# EAGLE design kb2040 (EAGLE 9.6.2)
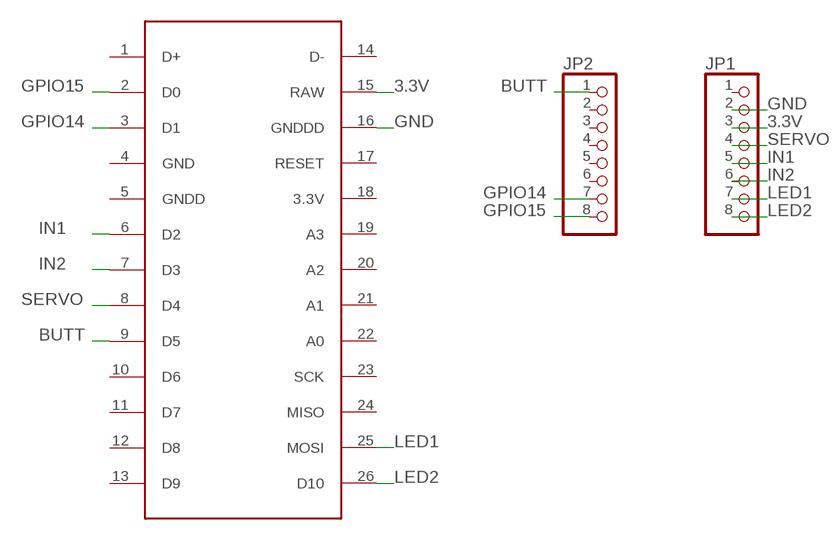
[diagram p0: schematic, sheet 1]

## Parts
JP1  PINHD-1X8  [1X08]
JP2  PINHD-1X8  [1X08]
U$1  KB2040  [KB2040]

## Nets
3.3V: JP1.3 U$1.15(RAW)
BUTT: JP2.1 U$1.9(D5)
GND: JP1.2 U$1.16(GNDDD)
GPIO14: JP2.7 U$1.3(D1)
GPIO15: JP2.8 U$1.2(D0)
IN1: JP1.5 U$1.6(D2)
IN2: JP1.6 U$1.7(D3)
LED1: JP1.7 U$1.25(MOSI)
LED2: JP1.8 U$1.26(D10)
SERVO: JP1.4 U$1.8(D4)
Unconnected: JP1.1 JP2.2 JP2.3 JP2.4 JP2.5 JP2.6 U$1.1(D+) U$1.4(GND) U$1.5(GNDD) U$1.10(D6) U$1.11(D7) U$1.12(D8) U$1.13(D9) U$1.14(D-) U$1.17(RESET) U$1.18(3.3V) U$1.19(A3) U$1.20(A2) U$1.21(A1) U$1.22(A0) U$1.23(SCK) U$1.24(MISO)

## Library data of the parts
JP1 JP2 = pinhead:PINHD-1X8: PIN HEADER
U$1 = KB2040:KB2040

## Board
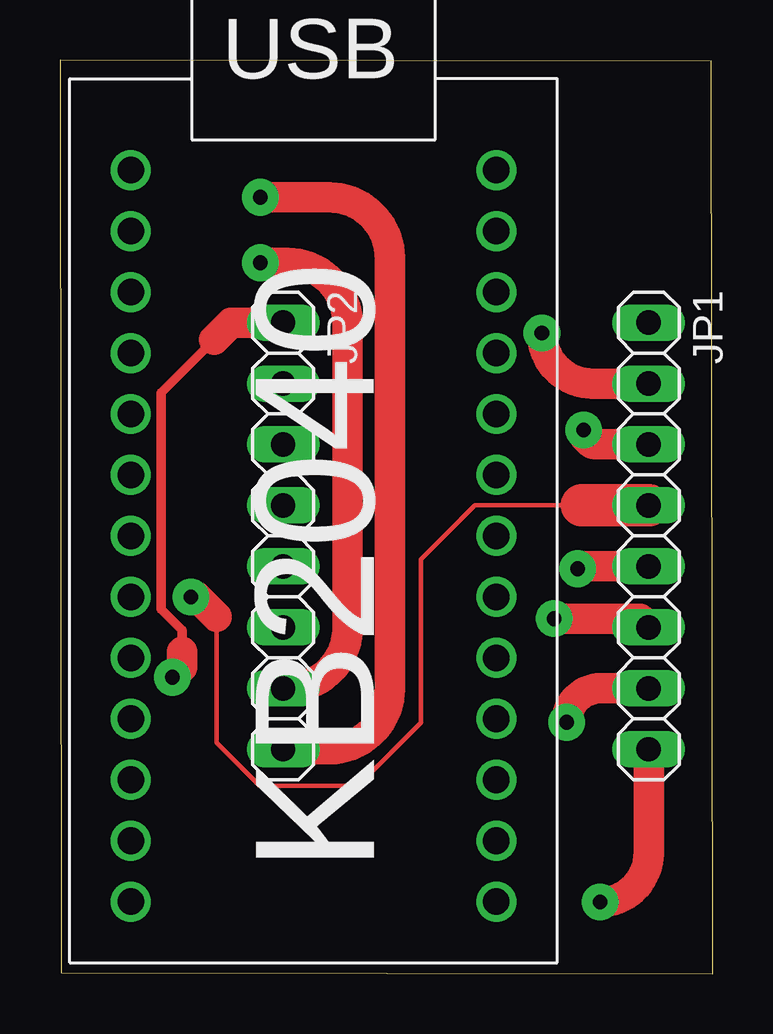
[diagram p1: board, top side]
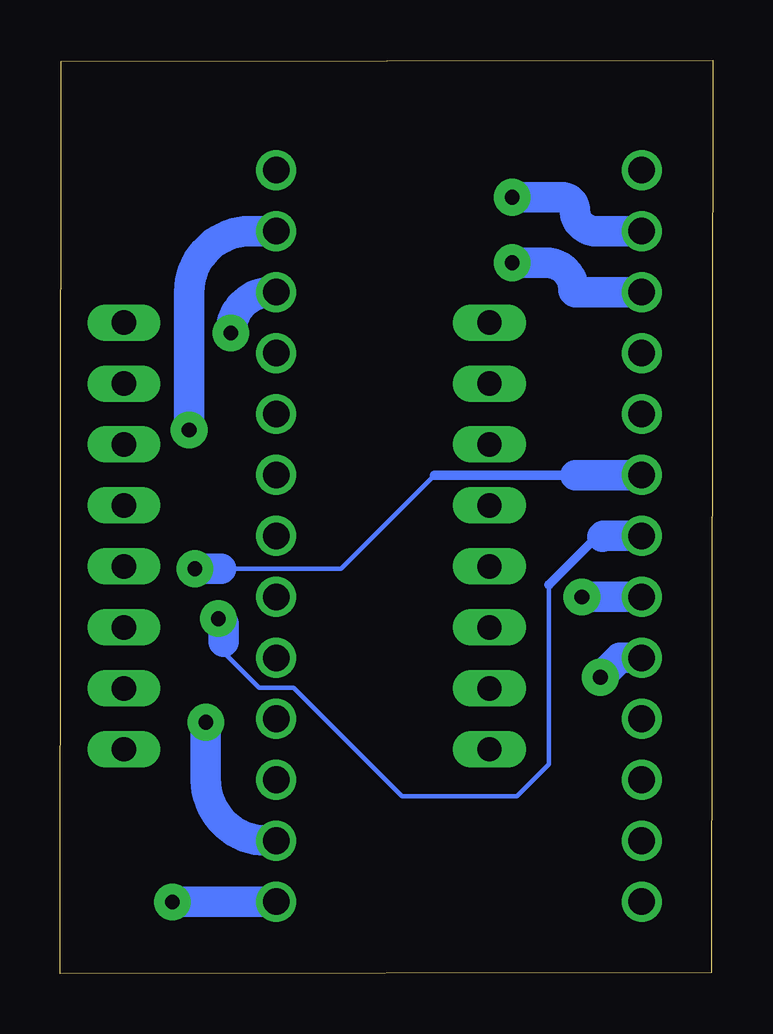
[diagram p2: board, bottom side, seen from below]

Size 27.21 x 38.08 mm. Coordinates in mm from the lower left corner, seen from the top.
Outline: 0.05,0.06 27.21,0 27.16,38.02 0,38.08 0.05,0.06
Copper layers (1*16): Top 0.035mm / dielectric 1.5mm / Bottom 0.035mm
Design rules "default *": minimum track width 6mil, minimum drill 0.35mm, track to track 0.4mm, track to pad 6mil, pad to pad 6mil, via to via 6mil, smd to smd 6mil, copper to edge 40mil, drill to drill 6mil, minimum pad ring 10mil, minimum via ring 8mil, stop-mask expansion 4mil, vias tented up to drill 0mil, thermal gap 10mil

### Footprints (pad centres in the part's own frame; a part is rotated, then mirrored left to right if it is on the bottom)
1X08 = drill 1.016 long: 1 -8.89,0; 2 -6.35,0; 3 -3.81,0; 4 -1.27,0; 5 1.27,0; 6 3.81,0; 7 6.35,0; 8 8.89,0
KB2040 = drill 1.11 pad 1.665: 1 -15.24,-8.89; 2 -12.7,-8.89; 3 -10.16,-8.89; 4 -7.62,-8.89; 5 -5.08,-8.89; 6 -2.54,-8.89; 7 0,-8.89; 8 2.54,-8.89; 9 5.08,-8.89; 10 7.62,-8.89; 11 10.16,-8.89; 12 12.7,-8.89; 13 15.24,-8.89; 14 -15.24,6.35; 15 -12.7,6.35; 16 -10.16,6.35; 17 -7.62,6.35; 18 -5.08,6.35; 19 -2.54,6.35; 20 0,6.35; 21 2.54,6.35; 22 5.08,6.35; 23 7.62,6.35; 24 10.16,6.35; 25 12.7,6.35; 26 15.24,6.35

### Placement (x,y rotation side)
JP1  24.54,18.25 270 top
JP2  9.3,18.25 270 top
U$1  11.84,18.25 270 top

### Tracks (layer width: path | path; a pad name or v marks a point on that pad's centre or on a via)
3.3V  (via drill 0.61 pad 1.52)
  Top 1.27: v21.83,22.66 arc90 22.42,22.06 JP1.3
  Bottom 1.27: U$1.15 19.29,30.95 arc-90 21.83,28.41 v21.83,22.66
BUTT  (via drill 0.61 pad 1.52)
  Top 0.4: 5.1,13.43 5.1,14.32 4.22,15.2 4.22,24.21 6.44,26.43
  Top 1.27: v4.68,12.36 5.1,12.78 5.1,13.43 | 6.44,26.43 7.15,27.14 JP2.1
  Bottom 1.27: U$1.9 3.87,13.17 v4.68,12.36
GND  (via drill 0.61 pad 1.52)
  Top 1.27: JP1.2 22.21,24.6 arc-90 v20.09,26.71
  Bottom 1.27: v20.09,26.71 arc90 18.4,28.41 U$1.16
GPIO14  (via drill 0.61 pad 1.52)
  Top 1.27: JP2.7 9.46,11.9 arc90 12,14.44 12,19.67 12,27.09 arc90 9.46,29.63 v8.36,29.63
  Bottom 1.27: v8.36,29.63 6.92,29.63 arc90 5.8,28.51 arc-90 5.7,28.41 U$1.3
GPIO15  (via drill 0.61 pad 1.52)
  Top 1.27: JP2.8 11.22,9.36 arc90 13.76,11.9 13.76,29.82 arc90 11.22,32.36 v8.36,32.36
  Bottom 1.27: v8.36,32.36 6.28,32.36 arc90 5.75,31.83 arc-90 4.87,30.95 U$1.2
IN1  (via drill 0.61 pad 1.52)
  Top 1.27: JP1.5 21.68,16.98 v21.59,16.88
  Bottom 0.178: 20.49,16.88 15.48,16.88 11.59,20.78
  Bottom 0.4: 11.59,20.78 5.72,20.78
  Bottom 1.27: v21.59,16.88 20.49,16.88 | 5.72,20.78 U$1.6
IN2  (via drill 0.61 pad 1.52)
  Top 1.27: v20.6,14.8 24.18,14.8 JP1.6
  Bottom 0.178: 6.83,16.22 6.83,8.73 8.16,7.39 12.96,7.39 17.48,11.91 18.91,11.91 20.4,13.4 20.4,13.85
  Bottom 0.4: 6.83,16.22 4.82,18.22 4.59,18.22
  Bottom 1.27: U$1.7 4.56,18.25 4.59,18.22 | 20.4,13.85 20.4,14.59 v20.6,14.8
LED1  (via drill 0.61 pad 1.52)
  Top 1.27: v21.13,10.49 arc-90 22.54,11.9 JP1.7
  Bottom 1.27: U$1.25 18.59,5.55 arc90 21.13,8.09 v21.13,10.49
LED2  (via drill 0.61 pad 1.52)
  Top 1.27: JP1.8 24.54,5.02 arc-90 v22.52,3
  Bottom 1.27: v22.52,3 U$1.26 arc-90 U$1.26
SERVO  (via drill 0.61 pad 1.52)
  Top 0.178: 21.77,19.53 17.3,19.53 15.06,17.28 15.06,10.47 12.42,7.84 8.31,7.84 6.53,9.63 6.53,14.89
  Top 1.27: 6.53,14.89 5.71,15.71 v5.45,15.71
  Top 1.778: JP1.4 21.78,19.52 21.77,19.53
  Bottom 1.27: v5.45,15.71 U$1.8